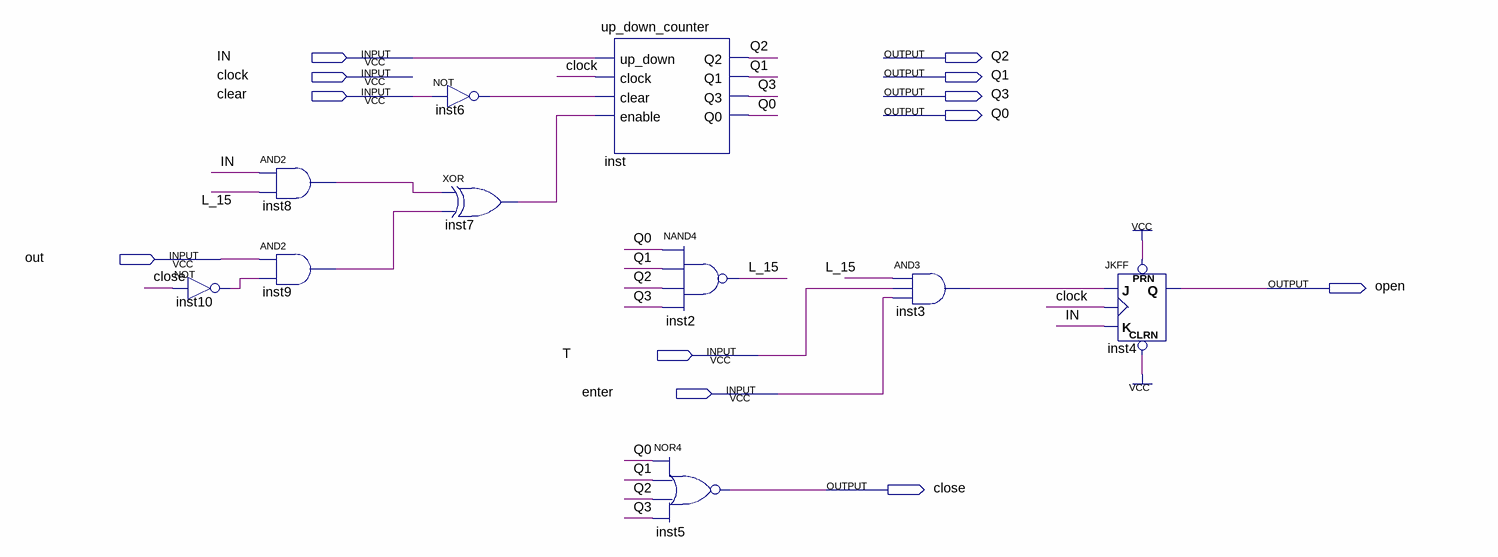
[diagram p0: schematic sheet]
// Quartus schematic final.bdf as structural Verilog: 10 symbols, 12 pins
module \final  (
  input  IN,
  input  clock,
  input  clear,
  input  out,
  input  T,
  input  enter,
  output Q2,
  output Q1,
  output Q3,
  output Q0,
  output open,
  output close
);

  wire inst3_out, inst6_out, inst7_out, inst8_out, inst9_out, inst10_out, L_15;

  not inst10 (inst10_out, close);
  and inst8 (inst8_out, IN, L_15);
  and inst9 (inst9_out, out, inst10_out);
  not inst6 (inst6_out, clear);
  xor inst7 (inst7_out, inst8_out, inst9_out);
  up_down_counter inst (
    .up_down(IN), .clock(clock), .clear(inst6_out), .enable(inst7_out), .Q2(Q2), .Q1(Q1), .Q3(Q3), .Q0(Q0));
  nand inst2 (L_15, Q0, Q1, Q2, Q3);
  nor inst5 (close, Q0, Q1, Q2, Q3);
  and inst3 (inst3_out, L_15, T, enter);
  JKFF inst4 (.PRN(1'b1), .CLRN(1'b1), .K(IN), .J(inst3_out), .CLK(clock), .Q(open));
endmodule
